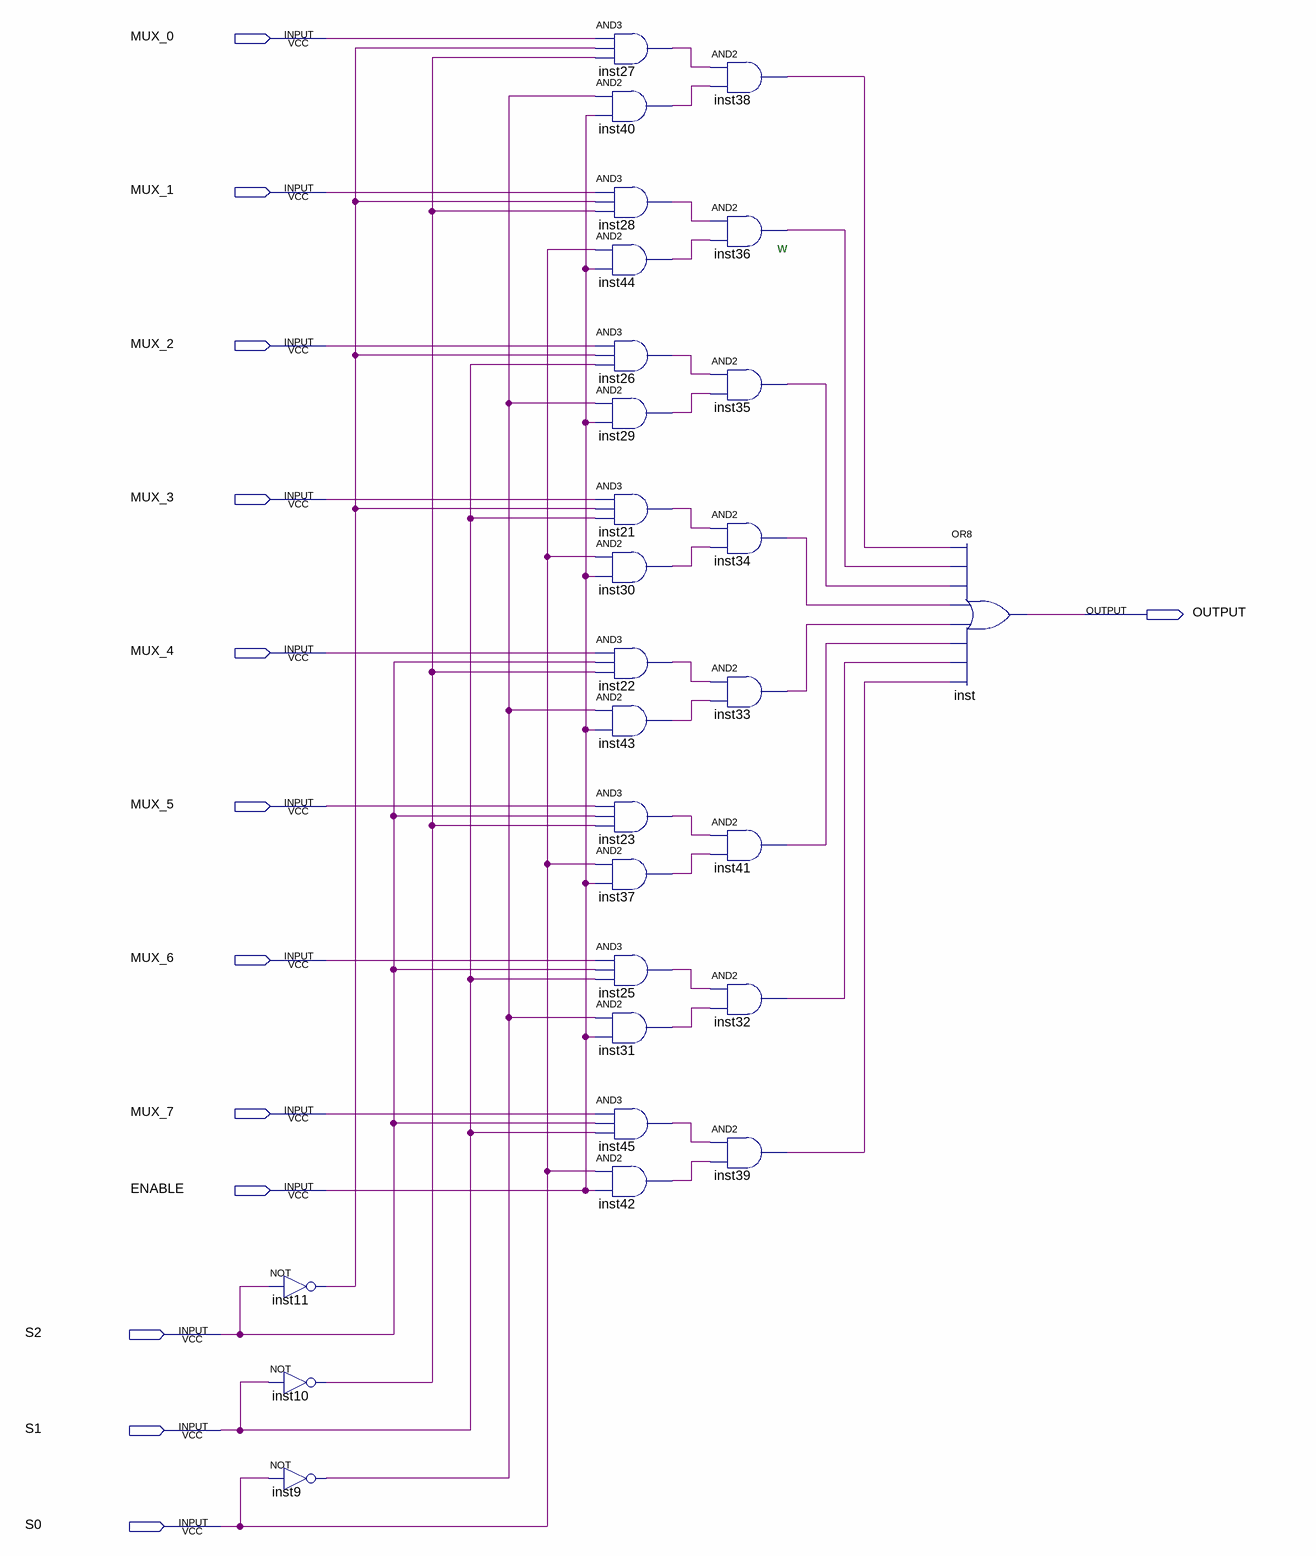
[diagram p0: schematic sheet]
// Quartus schematic 8_1_MUX.bdf as structural Verilog: 28 symbols, 13 pins
module \8_1_MUX  (
  input  MUX_0,
  input  MUX_1,
  input  MUX_2,
  input  MUX_3,
  input  MUX_4,
  input  MUX_5,
  input  MUX_6,
  input  MUX_7,
  input  ENABLE,
  input  S2,
  input  S1,
  input  S0,
  output OUTPUT
);

  wire inst9_out, inst10_out, inst11_out, inst21_out, inst22_out, inst23_out, inst25_out, inst26_out,
       inst27_out, inst28_out, inst29_out, inst30_out, inst31_out, inst32_out, inst33_out, inst34_out,
       inst35_out, inst36_out, inst37_out, inst38_out, inst39_out, inst40_out, inst41_out, inst42_out,
       inst43_out, inst44_out, inst45_out;

  not inst11 (inst11_out, S2);
  not inst10 (inst10_out, S1);
  not inst9 (inst9_out, S0);
  and inst27 (inst27_out, MUX_0, inst11_out, inst10_out);
  and inst40 (inst40_out, inst9_out, ENABLE);
  and inst28 (inst28_out, MUX_1, inst11_out, inst10_out);
  and inst44 (inst44_out, S0, ENABLE);
  and inst26 (inst26_out, MUX_2, inst11_out, S1);
  and inst29 (inst29_out, inst9_out, ENABLE);
  and inst21 (inst21_out, MUX_3, inst11_out, S1);
  and inst30 (inst30_out, S0, ENABLE);
  and inst22 (inst22_out, MUX_4, S2, inst10_out);
  and inst43 (inst43_out, inst9_out, ENABLE);
  and inst23 (inst23_out, MUX_5, S2, inst10_out);
  and inst37 (inst37_out, S0, ENABLE);
  and inst25 (inst25_out, MUX_6, S2, S1);
  and inst31 (inst31_out, inst9_out, ENABLE);
  and inst45 (inst45_out, MUX_7, S2, S1);
  and inst42 (inst42_out, S0, ENABLE);
  and inst38 (inst38_out, inst27_out, inst40_out);
  and inst36 (inst36_out, inst28_out, inst44_out);
  and inst35 (inst35_out, inst26_out, inst29_out);
  and inst34 (inst34_out, inst21_out, inst30_out);
  and inst33 (inst33_out, inst22_out, inst43_out);
  and inst41 (inst41_out, inst23_out, inst37_out);
  and inst32 (inst32_out, inst25_out, inst31_out);
  and inst39 (inst39_out, inst45_out, inst42_out);
  or inst (OUTPUT, inst38_out, inst36_out, inst35_out, inst34_out, inst33_out, inst41_out, inst32_out, inst39_out);

  // Notes on the sheet:
  //   w
endmodule
